# EAGLE design FT232 (EAGLE 9.6.2)
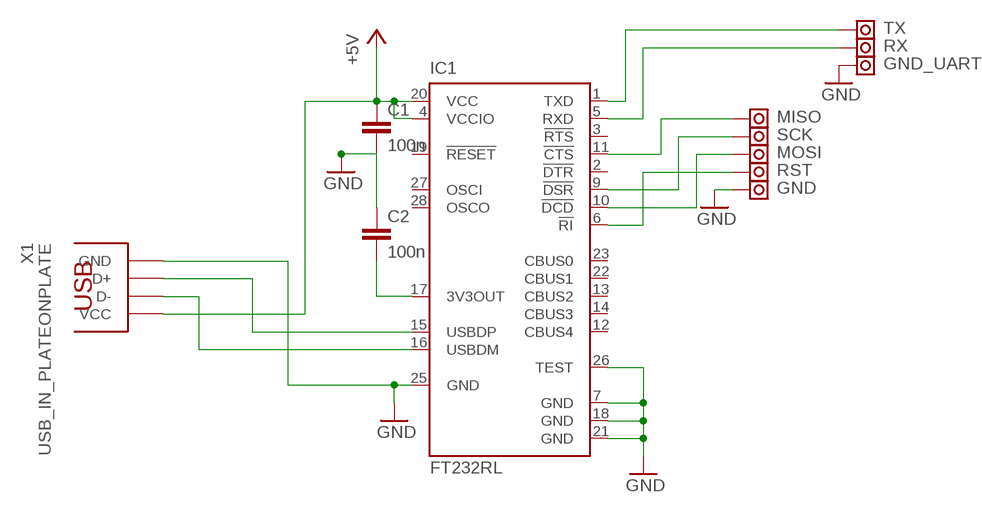
[diagram p0: schematic, sheet 1]

## Parts
C1  100n  C-EUC0805  [C0805]
C2  100n  C0805  [0805]
GND  PAD  [PAD]
GND_UART  PAD  [PAD]
IC1  FT232RL  [SSOP28]
MISO  PAD  [PAD]
MOSI  PAD  [PAD]
RST  PAD  [PAD]
RX  PAD  [PAD]
SCK  PAD  [PAD]
TX  PAD  [PAD]
X1  USB_IN_PLATEONPLATE  [USB_IN_PLATE]

## Nets
+5V: C1.1 IC1.4(VCCIO) IC1.20(VCC) X1.VCC
GND: C1.2 C2.1 GND.P$1(PAD) GND_UART.P$1(PAD) IC1.7(GND) IC1.18(GND) IC1.21(GND) IC1.25(GND) IC1.26(TEST) X1.GND
N$1: IC1.1(TXD) TX.P$1(PAD)
N$2: IC1.15(USBDP) X1.D+
N$3: IC1.16(USBDM) X1.D-
N$4: C2.2 IC1.17(3V3OUT)
N$5: IC1.5(RXD) RX.P$1(PAD)
N$10: IC1.11(!CTS) MISO.P$1(PAD)
N$11: IC1.9(!DSR) SCK.P$1(PAD)
N$12: IC1.10(!DCD) MOSI.P$1(PAD)
N$13: IC1.6(!RI) RST.P$1(PAD)
Unconnected: IC1.2(!DTR) IC1.3(!RTS) IC1.12(CBUS4) IC1.13(CBUS2) IC1.14(CBUS3) IC1.19(!RESET) IC1.22(CBUS1) IC1.23(CBUS0) IC1.27(OSCI) IC1.28(OSCO)

## Library data of the parts
C1 = rcl:C-EU: CAPACITOR, European symbol
C2 = usb:C0805
GND GND_UART MISO MOSI RST RX SCK TX = usb:PAD
IC1 = ftdichip:FT232R: Source: http://www.ftdichip.com/Documents/DataSheets/DS_FT232R_v104.pdf; MPN: FT232RL; OC_FARNELL: 1146032; OC_NEWARK: 91K9918
X1 = usb:USB_IN_PLATE

## Board
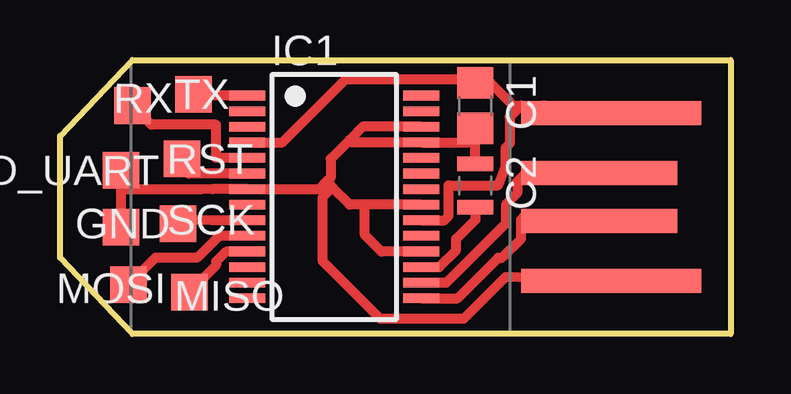
[diagram p1: board, top side]

Size 27.94 x 11.43 mm. Coordinates in mm from the lower left corner, seen from the top.
Outline: 0,8.26 3.02,11.43 27.94,11.43 27.94,0 3.02,0 0,3.17 0,8.26
Copper layers (1*16): Top 0.035mm / dielectric 1.5mm / Bottom 0.035mm
Design rules "default": minimum track width 12mil, minimum drill 32mil, track to track 12mil, track to pad 12mil, pad to pad 12mil, via to via 12mil, smd to smd 8mil, copper to edge 40mil, drill to drill 8mil, minimum pad ring 16mil, minimum via ring 12mil, stop-mask expansion 4mil, vias tented up to drill 0mil, thermal gap 20mil

### Footprints (pad centres in the part's own frame; a part is rotated, then mirrored left to right if it is on the bottom)
C0805 = smd 1.3 x 1.5: 1 -0.95,0; 2 0.95,0
0805 = smd 0.6 x 1.5: 1 -0.9,0; 2 0.9,0
PAD = smd 1.524 x 1.524: P$1 0,0
SSOP28 = smd 0.4 x 1.5: 1 -4.225,-3.625; 2 -3.575,-3.625; 3 -2.925,-3.625; 4 -2.275,-3.625; 5 -1.625,-3.625; 6 -0.975,-3.625; 7 -0.325,-3.625; 8 0.325,-3.625; 9 0.975,-3.625; 10 1.625,-3.625; 11 2.275,-3.625; 12 2.925,-3.625; 13 3.575,-3.625; 14 4.225,-3.625; 15 4.225,3.625; 16 3.575,3.625; 17 2.925,3.625; 18 2.275,3.625; 19 1.625,3.625; 20 0.975,3.625; 21 0.325,3.625; 22 -0.325,3.625; 23 -0.975,3.625; 24 -1.625,3.625; 25 -2.275,3.625; 26 -2.925,3.625; 27 -3.575,3.625; 28 -4.225,3.625
USB_IN_PLATE = smd 1 x 6.5: D+ -1,5; D- 1,5 | smd 1 x 7.5: GND -3.5,4.5; VCC 3.5,4.5

### Placement (x,y rotation side)
C1  17.3,9.53 270 top
C2  17.3,6.19 270 top
GND  2.54,4.45 0 top
GND_UART  2.54,6.83 0 top
IC1  11.43,5.71 270 top
MISO  5.4,1.75 0 top
MOSI  2.86,2.06 0 top
RST  5.08,7.3 0 top
RX  3.02,9.53 0 top
SCK  4.92,4.6 0 top
TX  5.56,10 0 top
X1  27.46,5.71 90 top

### Tracks (layer width: path | path; a pad name or v marks a point on that pad's centre or on a via)
+5V
  Top 0.406: X1.VCC 20.33,9.37 20.18,9.53 19.21,9.53 | IC1.20 16.01,4.74 16.19,4.92 16.19,6.19 18.26,6.19 18.57,6.99 18.57,7.78 18.73,7.94 18.73,9.05 19.21,9.53 | 19.21,9.53 18.89,9.53 17.78,10.63 C1.1 17.14,10.64 11.91,10.64 9.26,7.99 IC1.4
GND
  Top 0.406: C2.1 17.3,8.26 | 17.3,8.26 C1.2 | 17.3,8.26 17.04,7.99 IC1.25 12.17,7.99 12.06,8.1 | IC1.26 12.61,8.64 12.06,8.1 | 12.06,8.1 11.27,7.3 11.27,6.51 11.11,6.35 | 11.11,6.35 10.79,6.03 7.81,6.03 IC1.7 6.36,6.04 5.87,6.03 2.54,6.03 | IC1.21 12.7,5.39 | 12.7,5.39 12.07,5.39 11.35,6.11 | 11.35,6.11 11.11,6.35 | X1.GND 18.57,2.37 16.83,0.64 13.34,0.64 10.95,3.02 10.95,5.71 11.35,6.11 | IC1.18 13.39,3.44 12.7,4.13 12.7,5.39 | GND_UART.P$1 2.54,6.03 | 2.54,6.03 GND.P$1
N$1
  Top 0.406: IC1.1 5.62,9.94 TX.P$1
N$2
  Top 0.406: IC1.15 16.57,1.49 18.26,3.17 18.41,3.17 19.21,3.97 19.21,4.76 19.37,4.92 22.42,4.92 X1.D+
N$3
  Top 0.406: X1.D- 19.57,6.87 19.05,6.35 19.05,5.87 18.57,5.4 18.57,4.6 16.11,2.14 IC1.16
N$4
  Top 0.406: C2.2 17.3,4.76 16.51,3.97 16.51,3.49 15.81,2.79 IC1.17
N$5
  Top 0.406: IC1.5 6.51,7.34 6.51,8.73 3.81,8.73 RX.P$1
N$10
  Top 0.406: IC1.11 6.93,3.44 6.51,3.02 6.51,2.86 MISO.P$1
N$11
  Top 0.406: IC1.9 6.33,4.74 5.24,4.76 SCK.P$1
N$12
  Top 0.406: IC1.10 6.63,4.09 5.71,3.17 3.97,3.17 MOSI.P$1
N$13
  Top 0.406: IC1.6 5.38,6.69 RST.P$1